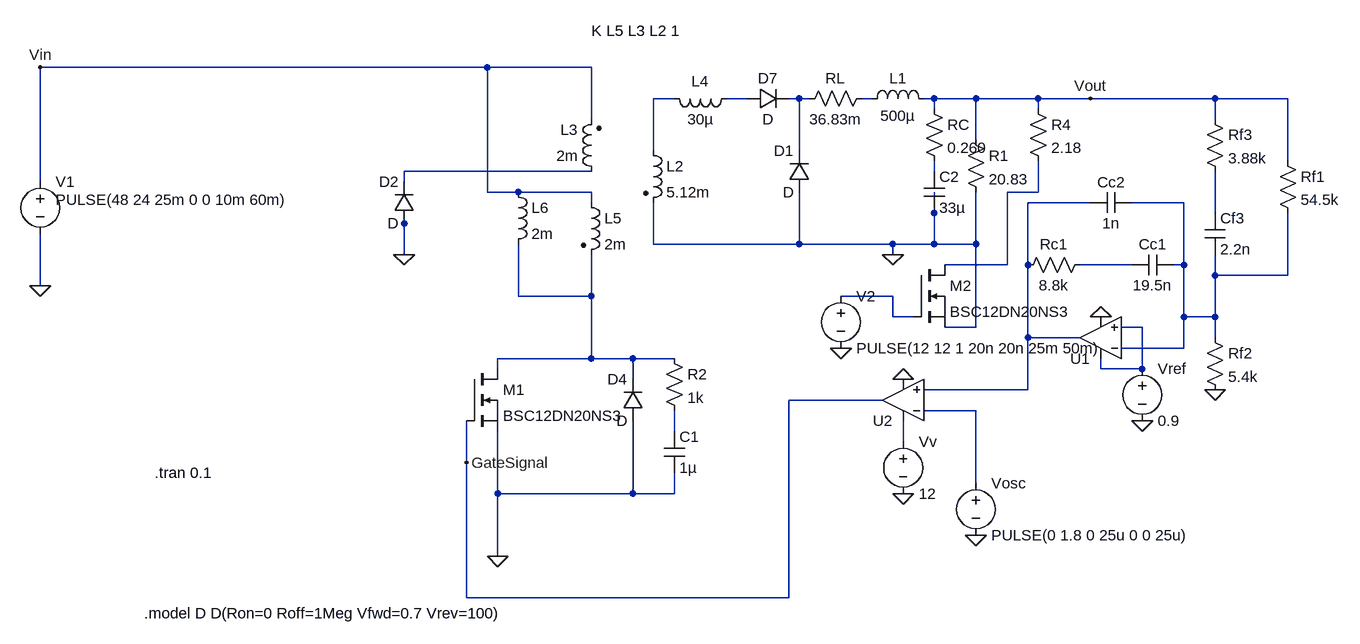
[diagram p0: schematic Forward.asc]
Forward.asc, the LTspice schematic file:
Version 4
SHEET 1 1412 1552
WIRE -400 -192 -1088 -192
WIRE -240 -192 -400 -192
WIRE -112 -144 -144 -144
WIRE 0 -144 -32 -144
WIRE 80 -144 64 -144
WIRE 96 -144 80 -144
WIRE 192 -144 176 -144
WIRE 288 -144 272 -144
WIRE 352 -144 288 -144
WIRE 448 -144 352 -144
WIRE 528 -144 448 -144
WIRE 720 -144 528 -144
WIRE 832 -144 720 -144
WIRE 288 -128 288 -144
WIRE 448 -128 448 -144
WIRE -240 -112 -240 -192
WIRE 720 -112 720 -144
WIRE 352 -80 352 -144
WIRE -144 -64 -144 -144
WIRE 80 -64 80 -144
WIRE 832 -48 832 -144
WIRE -240 -32 -528 -32
WIRE 288 -32 288 -48
WIRE -1088 -16 -1088 -192
WIRE -528 -16 -528 -32
WIRE -400 0 -400 -192
WIRE -352 0 -400 0
WIRE -240 0 -352 0
WIRE 448 0 448 -48
WIRE 448 0 400 0
WIRE -240 16 -240 0
WIRE 528 16 432 16
WIRE 672 16 592 16
WIRE 288 32 288 0
WIRE 720 32 720 -32
WIRE -528 48 -528 32
WIRE -144 80 -144 16
WIRE 80 80 80 0
WIRE 80 80 -144 80
WIRE 224 80 80 80
WIRE 288 80 288 32
WIRE 288 80 224 80
WIRE 352 80 352 0
WIRE 352 80 288 80
WIRE -528 96 -528 48
WIRE 224 96 224 80
WIRE 400 112 400 0
WIRE 400 112 304 112
WIRE 432 112 432 16
WIRE 592 112 512 112
WIRE 672 112 672 16
WIRE 672 112 656 112
WIRE 720 128 720 96
WIRE 832 128 832 32
WIRE 832 128 720 128
WIRE -1088 144 -1088 64
WIRE -352 160 -352 80
WIRE -240 160 -240 96
WIRE -240 160 -352 160
WIRE 224 160 144 160
WIRE 224 192 224 160
WIRE 256 192 224 192
WIRE 672 192 672 112
WIRE 720 192 720 128
WIRE 720 192 672 192
WIRE 352 208 352 80
WIRE 352 208 304 208
WIRE 608 208 576 208
WIRE 432 224 432 112
WIRE 512 224 432 224
WIRE 720 224 720 192
WIRE 672 240 672 192
WIRE 672 240 576 240
WIRE -240 256 -240 160
WIRE -240 256 -384 256
WIRE -176 256 -240 256
WIRE -112 256 -176 256
WIRE -384 272 -384 256
WIRE 544 272 544 256
WIRE 608 272 608 208
WIRE 608 272 544 272
WIRE -176 288 -176 256
WIRE 432 304 432 224
WIRE 432 304 272 304
WIRE 208 320 64 320
WIRE 352 336 272 336
WIRE -112 368 -112 336
WIRE 240 384 240 352
WIRE -432 416 -432 352
WIRE 352 448 352 336
WIRE -384 464 -384 368
WIRE -176 464 -176 352
WIRE -176 464 -384 464
WIRE -112 464 -112 432
WIRE -112 464 -176 464
WIRE -384 560 -384 464
WIRE -432 624 -432 416
WIRE 64 624 64 320
WIRE 64 624 -432 624
FLAG 224 96 0
FLAG -384 560 0
FLAG -528 96 0
FLAG -1088 144 0
FLAG 720 304 0
FLAG 544 192 0
FLAG 608 352 0
FLAG 352 528 0
FLAG 240 288 0
FLAG 240 464 0
FLAG -1088 -192 Vin
FLAG 528 -144 Vout
FLAG -432 416 GateSignal
FLAG 144 240 0
SYMBOL ind2 -160 -80 R0
SYMATTR InstName L2
SYMATTR Value 5.12m
SYMATTR Type ind
SYMBOL res 336 -96 R0
SYMATTR InstName R1
SYMATTR Value 20.83
SYMBOL nmos -432 272 R0
SYMATTR InstName M1
SYMATTR Value BSC12DN20NS3
SYMBOL diode 0 -128 R270
WINDOW 0 32 32 VTop 2
WINDOW 3 0 32 VBottom 2
SYMATTR InstName D7
SYMBOL diode 96 0 R180
WINDOW 0 24 64 Left 2
WINDOW 3 24 0 Left 2
SYMATTR InstName D1
SYMBOL ind 176 -128 R270
WINDOW 0 32 56 VTop 2
WINDOW 3 5 56 VBottom 2
SYMATTR InstName L1
SYMATTR Value 500µ
SYMATTR SpiceLine Rser=30m
SYMBOL ind2 -256 0 R0
SYMATTR InstName L5
SYMATTR Value 2m
SYMATTR Type ind
SYMBOL ind2 -224 -16 R180
WINDOW 0 36 80 Left 2
WINDOW 3 36 40 Left 2
SYMATTR InstName L3
SYMATTR Value 2m
SYMATTR Type ind
SYMBOL diode -512 48 R180
WINDOW 0 24 64 Left 2
WINDOW 3 24 0 Left 2
SYMATTR InstName D2
SYMBOL voltage -1088 -32 R0
WINDOW 123 0 0 Left 2
WINDOW 39 0 0 Left 2
WINDOW 3 24 44 Left 2
SYMATTR Value PULSE(48 24 25m 0 0 10m 60m)
SYMATTR InstName V1
SYMBOL cap 272 -32 R0
SYMATTR InstName C2
SYMATTR Value 33µ
SYMATTR SpiceLine Rser=1m
SYMBOL res -128 240 R0
SYMATTR InstName R2
SYMATTR Value 1k
SYMBOL cap -128 368 R0
SYMATTR InstName C1
SYMATTR Value 1µ
SYMBOL diode -160 352 R180
WINDOW 0 24 64 Left 2
WINDOW 3 24 0 Left 2
SYMATTR InstName D4
SYMBOL ind -16 -160 R90
WINDOW 0 5 56 VBottom 2
WINDOW 3 32 56 VTop 2
SYMATTR InstName L4
SYMATTR Value 30µ
SYMBOL ind -368 -16 R0
SYMATTR InstName L6
SYMATTR Value 2m
SYMBOL res 272 -144 R0
SYMATTR InstName RC
SYMATTR Value 0.260
SYMBOL res 192 -160 R90
WINDOW 0 0 56 VBottom 2
WINDOW 3 32 56 VTop 2
SYMATTR InstName RL
SYMATTR Value 36.83m
SYMBOL res 704 -128 R0
SYMATTR InstName Rf3
SYMATTR Value 3.88k
SYMBOL cap 704 32 R0
SYMATTR InstName Cf3
SYMATTR Value 2.2n
SYMBOL res 816 -64 R0
SYMATTR InstName Rf1
SYMATTR Value 54.5k
SYMBOL res 704 208 R0
SYMATTR InstName Rf2
SYMATTR Value 5.4k
SYMBOL cap 592 0 R90
WINDOW 0 0 32 VBottom 2
WINDOW 3 32 32 VTop 2
SYMATTR InstName Cc2
SYMATTR Value 1n
SYMBOL cap 656 96 R90
WINDOW 0 0 32 VBottom 2
WINDOW 3 32 32 VTop 2
SYMATTR InstName Cc1
SYMATTR Value 19.5n
SYMBOL res 528 96 R90
WINDOW 0 0 56 VBottom 2
WINDOW 3 32 56 VTop 2
SYMATTR InstName Rc1
SYMATTR Value 8.8k
SYMBOL Opamps\\UniversalOpamp2 544 224 R180
SYMATTR InstName U1
SYMBOL voltage 608 256 R0
SYMATTR InstName Vref
SYMATTR Value 0.9
SYMBOL Opamps\\UniversalOpamp2 240 320 R180
SYMATTR InstName U2
SYMBOL voltage 352 432 R0
WINDOW 123 0 0 Left 0
WINDOW 39 0 0 Left 0
SYMATTR InstName Vosc
SYMATTR Value PULSE(0 1.8 0 25u 0 0 25u)
SYMBOL voltage 240 368 R0
SYMATTR InstName Vv
SYMATTR Value 12
SYMBOL res 432 -144 R0
SYMATTR InstName R4
SYMATTR Value 2.18
SYMBOL nmos 256 112 R0
SYMATTR InstName M2
SYMATTR Value BSC12DN20NS3
SYMBOL voltage 144 144 R0
WINDOW 123 0 0 Left 2
WINDOW 39 0 0 Left 2
SYMATTR InstName V2
SYMATTR Value PULSE(12 12 1 20n 20n 25m 50m)
TEXT -240 -248 Left 2 !K L5 L3 L2 1
TEXT -912 432 Left 2 !.tran 0.1
TEXT -928 648 Left 2 !.model D D(Ron=0 Roff=1Meg Vfwd=0.7 Vrev=100)

The netlist it stands for:
* Forward.asc
L2 N001 0 5.12m
R1 Vout 0 20.83
M1 N012 GateSignal 0 0 BSC12DN20NS3
D7 N002 N003 D
D1 0 N003 D
L1 N004 Vout 500µ Rser=30m
L5 Vin N012 2m
L3 N005 Vin 2m
D2 0 N005 D
V1 Vin 0 PULSE(48 24 25m 0 0 10m 60m)
C2 N006 0 33µ Rser=1m
R2 N012 N016 1k
C1 N016 0 1µ
D4 0 N012 D
L4 N002 N001 30µ
L6 Vin N012 2m
RC Vout N006 0.260
RL N004 N003 36.83m
Rf3 Vout N010 3.88k
Cf3 N010 N009 2.2n
Rf1 Vout N009 54.5k
Rf2 N009 0 5.4k
Cc2 N009 N008 1n
Cc1 N009 N011 19.5n
Rc1 N011 N008 8.8k
XU1 N014 N009 N014 0 N008 level.2 Avol=1Meg GBW=10Meg Slew=10Meg ilimit=25m rail=0 Vos=0 phimargin=45 en=0 enk=0 in=0 ink=0 Rin=500Meg  ; pins IN+ IN- V+ V- OUT
Vref N014 0 0.9
XU2 N008 N015 N017 0 GateSignal level.2 Avol=1Meg GBW=10Meg Slew=10Meg ilimit=25m rail=0 Vos=0 phimargin=45 en=0 enk=0 in=0 ink=0 Rin=500Meg  ; pins IN+ IN- V+ V- OUT
Vosc N015 0 PULSE(0 1.8 0 25u 0 0 25u)
Vv N017 0 12
R4 Vout N007 2.18
M2 N007 N013 0 0 BSC12DN20NS3
V2 N013 0 PULSE(12 12 1 20n 20n 25m 50m)
.model D D
.lib standard.dio
.model NMOS NMOS
.model PMOS PMOS
.lib standard.mos
K L5 L3 L2 1
.tran 0.1
.model D D(Ron=0 Roff=1Meg Vfwd=0.7 Vrev=100)
.lib UniversalOpamps2.sub
.backanno
.end